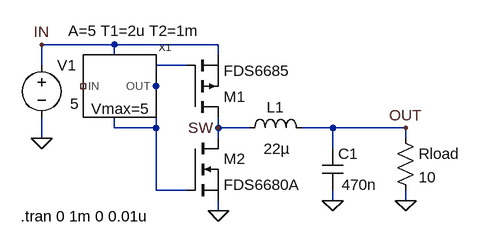
[diagram p0: schematic PWMdemodSync.asc]
PWMdemodSync.asc, the LTspice schematic file:
Version 4
SHEET 1 2900 1300
WIRE 2160 848 2048 848
WIRE 2320 848 2160 848
WIRE 2160 864 2160 848
WIRE 2320 864 2320 848
WIRE 2048 880 2048 848
WIRE 2272 880 2224 880
WIRE 2160 976 2160 960
WIRE 2224 976 2224 880
WIRE 2224 976 2160 976
WIRE 2320 976 2320 960
WIRE 2368 976 2320 976
WIRE 2496 976 2448 976
WIRE 2608 976 2496 976
WIRE 2048 992 2048 960
WIRE 2320 992 2320 976
WIRE 2608 992 2608 976
WIRE 2496 1008 2496 976
WIRE 2224 1072 2224 976
WIRE 2272 1072 2224 1072
WIRE 2496 1088 2496 1072
WIRE 2608 1088 2608 1072
WIRE 2320 1104 2320 1088
FLAG 2048 992 0
FLAG 2320 1104 0
FLAG 2496 1088 0
FLAG 2608 1088 0
FLAG 2608 976 OUT
FLAG 2048 848 IN
FLAG 2320 976 SW
SYMBOL VOLTAGE 2048 864 R0
WINDOW 3 44 75 Left 0
SYMATTR Value 5
SYMATTR InstName V1
SYMBOL ind 2352 992 R270
WINDOW 0 32 56 VTop 0
WINDOW 3 -1 58 VBottom 0
SYMATTR InstName L1
SYMATTR Value 22µ
SYMATTR SpiceLine Rpar=1G
SYMBOL cap 2480 1008 R0
WINDOW 123 31 81 Left 0
WINDOW 3 30 56 Left 0
SYMATTR Value 470n
SYMATTR InstName C1
SYMBOL res 2592 976 R0
SYMATTR InstName Rload
SYMATTR Value 10
SYMBOL PWM 2160 912 R0
WINDOW 39 -71 -85 Left 0
SYMATTR SpiceLine A=5 T1=2u T2=1m
SYMATTR InstName X1
SYMBOL pmos 2272 960 M180
SYMATTR InstName M1
SYMATTR Value FDS6685
SYMBOL nmos 2272 992 R0
SYMATTR InstName M2
SYMATTR Value FDS6680A
TEXT 2016 1112 Left 0 !.tran 0 1m 0 0.01u

The netlist it stands for:
* PWMdemodSync.asc
V1 IN 0 5
L1 SW OUT 22µ Rpar=1G
C1 OUT 0 470n
Rload OUT 0 10
XX1 NC_01 N001 PWM A=5 T1=2u T2=1m Vmax=5  ; pins IN OUT
M1 SW N001 IN IN FDS6685
M2 SW N001 0 0 FDS6680A
.model NMOS NMOS
.model PMOS PMOS
.lib standard.mos
.tran 0 1m 0 0.01u
.lib BLDCSupport.lib
.backanno
.end